# Altium schematic sheet vaja_1.SchDoc
size A4
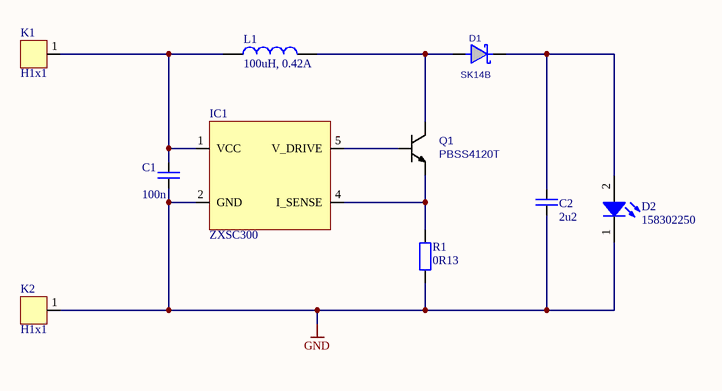
[diagram p0: vaja_1.SchDoc]

## Parts
C1  100n  [C2012_0805I_M]
C2  2u2  [C2012_0805I_M]
D1  SK14B  [DO-214AA_SMB_L]
D2  158302250  [WL-SWTP_3022]
IC1  ZXSC300  [SOT23-5]
K1  H1x1  [H1x1]
K2  H1x1  [H1x1]
L1  100uH, 0.42A  [WE-LQFS_4818]
Q1  PBSS4120T  [SOT23-3_L]
R1  0R13  [R2012_0805I_M]

## Nets
GND: C1.2 C2.2 D2.1(K) IC1.2(GND) K2.1 R1.2
NetC1_1: C1.1 IC1.1(VCC) K1.1 L1.1
NetC2_1: C2.1 D1.1(K) D2.2(A)
NetD1_2: D1.2(A) L1.2 Q1.C
NetIC1_4: IC1.4(I_SENSE) Q1.E R1.1
NetIC1_5: IC1.5(V_DRIVE) Q1.B

## Library data of the parts
C1 C2 = C: Capacitor
D1 = SK14B: Schottky; Value: *
D2 = 158302250: WL-SWTP SMT White Top view PLCC, size 3022, Daylight, 3.2V, 120deg; Manufacturer: Wurth Elektronik; Color Rendering Index typ.: 85; Correlated Color Temperature typ.: 5000K; Luminous Flux typ.: 22lm; Chip Technology: InGaN; Viewing Angle: 120deg; Published Date: April 2021; ComponentLink1URL: http://www.we-online.de; Size: 3022; Emitting Color: Daylight; Forward Voltage typ.: 3.2V; ComponentLink2URL: https://www.we-online.com/catalog/datasheet/158302250.pdf; ComponentLink1Description: Manufacturer; ComponentLink2Description: Datasheet; Manufacturer Part Number: 158302250; Operating Temperature: -40 to +85degC; Mounting Technology: SMT; Packaging: Tape and Reel
IC1 = ZXSC300: Led driver IC
K1 K2 = H1x1: Header 1x1 (male)
L1 = 74406042101: WE-LQFS SMT Power Inductor, size 4818, 100uH, 0.42A; Manufacturer: Wurth Elektronik; Self Resonant Frequency: 15MHz; DC Resistance typ.: 1155mOhm; DC Resistance max.: 1386mOhm; Saturation Current: 0.32A; ComponentLink1Description: Manufacturer; ComponentLink1URL: http://www.we-online.de; ComponentLink2Description: Datasheet; ComponentLink2URL: https://www.we-online.com/catalog/datasheet/74406042101.pdf; Mounting Technology: SMT; Operating Temperature: -40 to +125degC; Packaging: Tape and Reel; Published Date: April 2020; Inductance: 100uH; Manufacturer Part Number: 74406042101; Rated Current: 0.42A; Size: 4818
Q1 = BC817: pin to pad: B>1 C>3 E>2; Value: {Value}
R1 = R